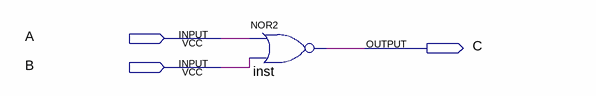
[diagram p0: schematic sheet]
// Quartus schematic norgate.bdf as structural Verilog: 1 symbols, 3 pins
module norgate (
  input  A,
  input  B,
  output C
);

  nor inst (C, A, B);
endmodule
